# EasyEDA Pro project ProProject_BBM-USB_2024-03-22.epro, board PCB_BSBM-USB-O_3
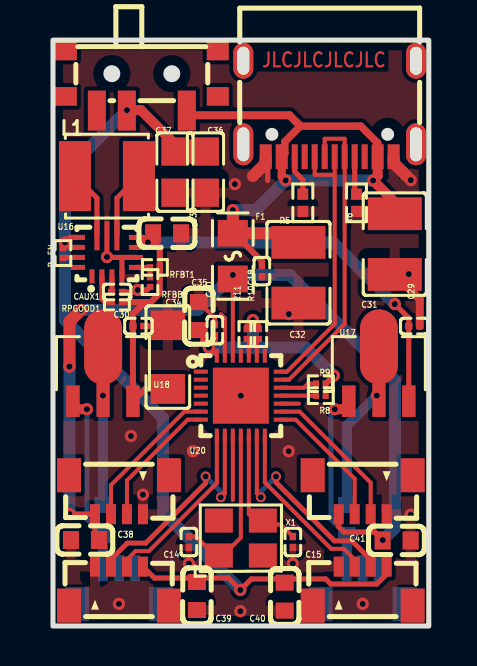
[diagram p7: board, top side]
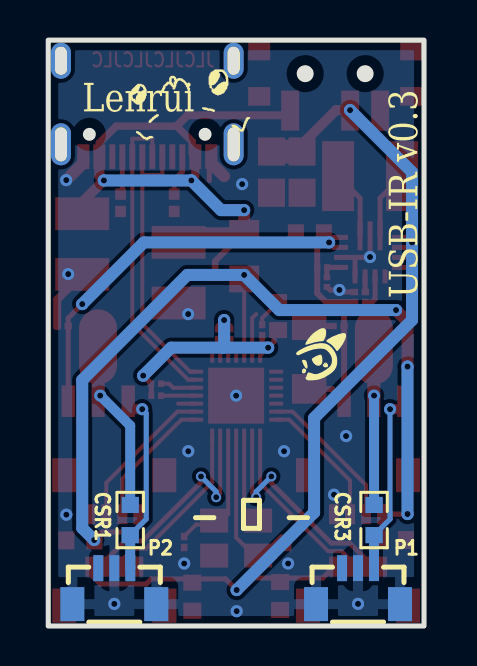
[diagram p8: board, bottom side, seen from below]

Outline 18.8 x 29.3 mm; copper layers: Top Layer, Top Inner1, Bottom Inner2, Bottom Layer. Coordinates in mm from the lower left corner of the outline.
Outline path: rectangle 0,29.3 18.8,0
Stack: Top Layer 0.035mm 外层铜厚1oz / Dielectric1 0.28mm 7628 RC49% 8.6mil / Top Inner1 0.035mm 内层铜厚 / Dielectric2 0.28mm 1.1mm H/HOZ 含铜 / Bottom Inner2 0.035mm 内层铜厚 / Dielectric3 0.28mm 7628 RC49% 8.6mil / Bottom Layer 0.035mm 外层铜厚1oz

## Design rules (mm)
template: User Custom Config
spacing Default (default): track to track 0.152, other pairs 0 to 0.152
track width Default (default): min 0.127, default 0.254, max 2.54
differential pair differentialPair (default): width min 0.127, default 0.254, max 2.54; gap min 0.152, default 0.152
via Default (default): diameter min 0.5, default 0.61, max 100.025; hole min 0.3, default 0.305, max 59.995

## Placement (name value [footprint] x y rotation side)
C14  12pF  [C0201]  6.8 4.2 270 top
C15  12pF  [C0201]  12 4.2 270 top
C18  100nF  [C0201]  10.45 17.75 270 top
C20  100nF  [C0201]  8.1 14.8 90 top
C29  100nF  [C0201]  18.07 15 180 top
C30  100nF  [C0201]  4.27 15 0 top
C31  100uF  [C1210]  17.1 19.1 90 top
C32  100uF  [C1210]  12.28 17.67 90 top
C33  10uF  [C0603]  5.71 19.64 0 top
C34  47uF  [C1206]  5.75 13.45 270 top
C35  10uF  [C0603]  7.3 15.5 90 top
C36  22uF  [C0805]  7.63 22.7 270 top
C37  22uF  [C0805]  6.1 22.7 270 top
C38  100uF  [C0603]  1.6 4.3 0 top
C39  100uF  [C0603]  7.2 1.5 270 top
C40  100uF  [C0603]  11.59 1.47 270 top
C41  100uF  [C0603]  17.19 4.28 0 top
CAUX1  100nF  [C0201]  3.21 16.7 0 top
CSR1  536Ω  [R0603]  14.7 5.3 270 bottom
CSR3  536Ω  [R0603]  2.5 5.3 270 bottom
F1  SMD0805B050TF  [F0805]  9 18.5 270 top
L1  2.2uH  [IND-SMD_L4.0-W4.0]  2.7 22.5 0 top
P1  SM03B-SURS-TF(LF)(SN)  [CONN-SMD_SM03B-SURS-TF-LF-SN]  3.3 1.99 0 bottom
P2  SM03B-SURS-TF(LF)(SN)  [CONN-SMD_SM03B-SURS-TF-LF-SN]  15.49 1.99 0 bottom
R5  5.1kΩ  [R0402]  12.5 21.17 90 top
R6  5.1kΩ  [R0402]  15.18 21.17 90 top
R8  DNP(56K)  [R0201]  13.4 11.52 180 top
R9  DNP(56K)  [R0201]  13.4 12.12 180 top
R10  DNP(56K)  [R0201]  10.3 14.6 270 top
R11  DNP(56K)  [R0201]  9.7 14.6 270 top
R-EN  10kΩ  [R0201]  0.5 18.65 270 top
RFBB1  100kΩ  [R0201]  4.86 17.2 90 top
RFBT1  845kΩ  [R0201]  5.1 17.93 0 top
RPGOOD1  100kΩ  [R0201]  3.2 16.2 0 top
SW1  MK-12C02-G020  [SW-SMD_MK-12C02-G020]  4.44 27.27 180 top
U12  SM04B-SURS-TF(LF)(SN)  [CONN-SMD_SM04B-SURS-TF-LF-SN]  3.3 6.57 180 top
U13  SM04B-SURS-TF(LF)(SN)  [CONN-SMD_SM04B-SURS-TF-LF-SN]  3.3 1.99 0 top
U14  SM04B-SURS-TF(LF)(SN)  [CONN-SMD_SM04B-SURS-TF-LF-SN]  15.49 1.99 0 top
U15  SM04B-SURS-TF(LF)(SN)  [CONN-SMD_SM04B-SURS-TF-LF-SN]  15.49 6.57 180 top
U16  TPS63070RNMR  [VQFN-HR-15_L3.0-W2.5-P0.50-BL_TPS63070RNMR]  2.7 18.5 0 top
U17  LM317LIPK  [SOT-89_L4.5-W2.5-P1.50-LS4.2-BR]  16.3 12.6 270 top
U18  LM317LIPK  [SOT-89_L4.5-W2.5-P1.50-LS4.2-BR]  2.5 12.6 270 top
U19  GT-USB-7010ASV  [USB-C-SMD_G-SWITCH_GT-USB-7010ASV]  13.84 25.87 180 top
U20  CH335F  [QFN-28_L4.0-W4.0-P0.40-TL-EP2.8]  9.4 11.52 0 top
X1  12MHz  [OSC-SMD_4P-L3.2-W2.5-BL]  9.4 4.4 0 top

## Footprints (pads in the part's own frame, mm; a bottom-side part is the same pattern mirrored in y, then rotated)
C0201
  rect 0.368x0.324 smd: 1(-0.275,0) 2(0.275,0)
C0603
  rect 0.8x0.9 smd: 1(-0.7,0) 2(0.7,0)
C0805
  rect 1.41x1.35 smd: 1(-1.03,0) 2(1.03,0)
C1206
  rect 1.485x1.728 smd: 1(-1.593,0) 2(1.593,0)
C1210
  rect 1.635x2.7 smd: 1(-1.518,0) 2(1.518,0)
CONN-SMD_SM03B-SURS-TF-LF-SN
  rect 0.5x1.3 smd: 1(0.8,-0.899) 2(0,-0.899) 3(-0.8,-0.9)
  rect 1.2x1.7 smd: 4(-2.1,0.9) 5(2.1,0.9)
CONN-SMD_SM04B-SURS-TF-LF-SN
  rect 0.5x1 smd: 1(-1.2,0.975) 2(-0.4,0.975) 3(0.4,0.975) 4(1.2,0.975)
  rect 1.2x1.7 smd: 5(2.5,-0.975) 6(-2.5,-0.975)
F0805
  rect 1.335x1.5 smd: 1(-1.143,0) 2(1.143,0)
IND-SMD_L4.0-W4.0
  rect 1.6x3.5 smd: 1(-1.6,0) 2(1.6,0)
OSC-SMD_4P-L3.2-W2.5-BL
  rect 1.4x1.2 smd: 1(-1.1,-0.875) 2(1.1,-0.875) 3(1.1,0.875) 4(-1.1,0.875)
QFN-28_L4.0-W4.0-P0.40-TL-EP2.8
  rect 0.7x0.2 smd: 1(-2,1.2) 2(-2,0.8) 3(-2,0.4) 4(-2,0.001) 5(-2,-0.4) 6(-2,-0.8) 7(-2,-1.2) 15(2,-1.2) 16(2,-0.8) 17(2,-0.4) 18(2,0) 19(2,0.4) 20(2,0.8) 21(2,1.2)
  rect 0.2x0.7 smd: 8(-1.2,-2) 9(-0.8,-2) 10(-0.4,-2) 11(0,-2) 12(0.4,-2) 13(0.8,-2) 14(1.2,-2) 22(1.2,2) 23(0.8,2) 24(0.4,2) 25(0,2) 26(-0.4,2) 27(-0.8,2) 28(-1.2,2)
  rect 2.8x2.8 smd: 29(0.001,-0.001)
R0201
  rect 0.303x0.324 smd: 1(-0.241,0) 2(0.241,0)
R0402
  rect 0.566x0.54 smd: 1(-0.433,0) 2(0.433,0)
R0603
  rect 0.806x0.864 smd: 1(-0.753,0) 2(0.753,0)
SOT-89_L4.5-W2.5-P1.50-LS4.2-BR
  rect 1.575x0.672 smd: 1(1.356,-1.5) 3(1.356,1.5)
  custom 5.377x1.9 smd: 2(-1.356,0.009)
SW-SMD_MK-12C02-G020
  rect 0.9x2 smd: 1(-2.25,1.49) 2(0.75,1.49) 3(2.25,1.49)
  rect 1.1x0.93 smd: 4(3.8,0.779) 5(3.8,-1.49) 6(-3.8,-1.49) 7(-3.8,0.779)
USB-C-SMD_G-SWITCH_GT-USB-7010ASV
  oval 1x2.1 hole 0.6x1.7: 1(-4.32,1.78) 2(4.32,1.78)
  oval 1x1.8 hole 0.6x1.4: 3(4.32,-2.4) 4(-4.32,-2.4)
  rect 0.6x1.24 smd: A1B12(-3.2,2.4) A4B9(-2.4,2.4) B1A12(3.2,2.4) B4A9(2.4,2.4)
  rect 0.3x1.24 smd: A5(-1.25,2.4) A6(-0.25,2.4) A7(0.25,2.4) A8(1.25,2.4) B5(1.75,2.4) B6(0.75,2.4) B7(-0.75,2.4) B8(-1.75,2.4)
VQFN-HR-15_L3.0-W2.5-P0.50-BL_TPS63070RNMR
  rect 0.25x0.7 smd: 1(-0.75,-1.016) 2(-0.25,-1.016) 3(0.25,-1.016) 4(0.75,-1.016)
  rect 0.7x0.25 smd: 5(1.45,-0.566) 6(1.45,-0.066) 7(1.45,0.434) 8(1.45,0.934) 12(-1.45,0.434) 13(-1.45,0.934) 14(-1.45,-0.066) 15(-1.45,-0.566)
  rect 0.25x1.45 smd: 9(0.5,1.016) 11(-0.5,1.016)
  rect 0.25x1.85 smd: 10(0,0.817)

## Nets
7.5VO: C29.2 C30.1 C33.1 C34.2 RFBT1.2 RPGOOD1.2 U16.7 U16.8 U17.3 U18.3
GND: C14.2 C15.2 C18.2 C20.2 C29.1 C30.2 C31.1 C32.1 C33.2 C34.1 C35.2 C36.2 C37.2 C38.1 C39.2 C40.2 C41.2 CAUX1.2 P1.2 P1.4 P1.5 P2.2 P2.4 P2.5 R5.1 R6.1 RFBB1.1 U12.1 U13.1 U14.1 U15.1 U16.4 U16.6 U16.10 U19.A1B12 U19.B1A12 U20.27 U20.29
VCC5: C38.2 C41.1 F1.2 U12.4 U15.4 U20.26
VCC33: C20.1 C35.1 R8.1 R9.1 R10.1 R11.1 U20.28
VIN: C18.1 C31.2 C32.2 F1.1 SW1.1 U19.A4B9 U19.B4A9
CSR1: CSR1.1 U17.2
CSR3: CSR3.1 U18.2
DM1: U12.3 U20.6
DM2: U13.3 U20.8
DM3: U14.3 U20.13
DM4: U15.3 U20.15
DMU: U19.A7 U19.B7 U20.20
DP1: U12.2 U20.7
DP2: U13.2 U20.9
DP3: U14.2 U20.14
DP4: U15.2 U20.16
DPU: U19.A6 U19.B6 U20.21
EN: R-EN.2 U16.14
FB: RFBB1.2 RFBT1.1 U16.5
IRO1: CSR3.2 P1.3 U18.1
IRO2: CSR1.2 P2.3 U17.1
L1: L1.1 U16.11
L2: L1.2 U16.9
LED1: U20.1
LED2: U20.3
LED3: U20.22
LED4: U20.25
OVCUR1: R11.2 U20.24
OVCUR2: R10.2 U20.23
OVCUR3: R9.2 U20.19
OVCUR4: R8.2 U20.18
PG: RPGOOD1.1 U16.2
PWREN1: U20.4
PWREN2: U20.2
PWREN3: U20.10
PWREN4: U20.5
USBO: C36.1 C37.1 C39.1 C40.1 R-EN.1 SW1.2 U13.4 U14.4 U16.12 U16.13
VAUX: CAUX1.1 U16.3
XI: C14.1 U20.11 X1.1
XO: C15.1 U20.12 X1.3
$1N11513: R5.2 U19.B5
$1N11542: R6.2 U19.A5

Pads without a net: P1 1; P2 1; SW1 3 4 5 6 7; U12 5 6; U13 5 6; U14 5 6; U15 5 6; U16 1 15; U19 1 2 3 4 A8 B8; U20 17; X1 2 4

## Via types
v1: diameter 0.61, hole 0.305, Top Layer to Bottom Layer, 37 vias
v2: diameter 0.5, hole 0.3, Top Layer to Bottom Layer, 4 vias

## Routing (per net, layer and track width the routed paths; a pad name or vN(x,y) marks a point on that pad's centre or on a via; arc(x,y) is an arc through that point)
7.5VO: length 33.2
  Top Layer w0.254: 17.8,14.9 17.8,15.4 v1(17.1,16.1) ; U16.8 4.5,19.43 v1(4.75,19.18) 4.5,18.93 U16.7 ; 17.8,10.64 17.8,14.83
  Top Layer w0.3: v1(4.75,19.18) 5.1,19.18 5.34,18.94 RFBT1.2 5.34,16.64 4.9,16.2 4.6,16.2 ; 4,10.64 U18.3 ; U18.3 4,14.94 ; U18.3 4.61,11.86 5.55,11.86 ; 4.6,16.2 4,15.6 C30.1 ; 4.6,16.2 3.54,16.2
  Bottom Layer w0.6: v1(17.1,16.1) 14.02,19.18 v1(4.75,19.18)
GND: length 15.5
  Top Layer w0.2: 8.4,15.6 8.6,15.4 U20.27 ; C35.2 8.1,15.4 C20.2
  Top Layer w0.254: U16.6 3.41,18.43 ; 3.41,18.43 2.72,18.43 v1(2.7,18.45) ; 3.41,18.43 3.45,18.39 U16.4 ; 10.64,23.47 10.74,23.37 10.74,22.28 ; CAUX1.2 4.13,16.7 v1(4.23,16.81) 4.71,16.81 RFBB1.1
  Top Layer w0.3: C34.1 5.7,15 C30.2
  Top Layer w0.4: C31.1 18.35,16.33 C29.1
  Top Layer w0.6: 10.64,23.47 10.64,23.14 10,22.5 ; 17.04,23.47 17.04,23.16 17.7,22.5
  vias: v1(3.3,1.11) v1(3.9,9.5) v1(4.5,6.57) v1(6.8,3.13) v1(7,8.74) v1(9.1,22.1) v1(9.4,11.52) v1(9.37,0.74) v1(11.8,15.6) v1(11.79,8.74) v1(12,3.13) v1(15.49,1.11) v1(17.8,17.6) v1(17.9,22.3) v1(17.89,5.57)
VCC5: length 47.1
  Top Layer w0.2: v1(9,17.56) U20.26
  Top Layer w0.254: U15.4 14.29,4.97 14.56,4.7 16.1,4.7 v1(16.5,4.3) ; 2.1,4.3 2.1,5.38 1.88,5.6 v1(0.83,5.6)
  Top Layer w0.5: 2.1,5.38 2.1,5.59 U12.4
  Top Layer w0.6: v1(0.83,12.97) 0.83,15.23 v1(1.4,15.8)
  Bottom Layer w0.254: v1(0.83,12.97) 0.8,13
  Bottom Layer w0.6: v1(16.5,4.3) 17.1,4.9 17.1,12.3 11.84,17.56 v1(9,17.56) 7.24,15.8 v1(1.4,15.8) ; v1(0.83,5.6) v1(0.83,12.97)
VCC33: length 13
  Top Layer w0.2: U20.28 v1(7.8,13.92)
  Top Layer w0.254: R9.1 14.04,12.52 14.05,12.52 13.64,12.11 R8.1 ; 7.5,14.43 7.5,14.22 v1(7.8,13.92) 8.1,14.22 8.1,14.43 ; R11.1 9.7,15 v1(10,15.3) 10.3,15 R10.1
  Bottom Layer w0.6: v1(10,15.3) 10,13.98 10.06,13.92 ; 10.06,13.92 v1(7.8,13.92) ; 10.06,13.92 12.65,13.92 v1(14.05,12.52)
VIN: length 31.9
  Top Layer w0.3: 9.25,19.64 9.25,19.45 10.45,18.25 C18.1
  Top Layer w0.37: 11.44,23.47 11.6,23.63 11.6,24.22 12.38,25 15.4,25 16.24,24.16 16.24,23.47
  Top Layer w0.4: v1(11.64,22.28) 11.44,22.48 11.44,23.47 ; SW1.1 6.93,25.54 11.83,25.54 12.38,25
  Top Layer w0.5: C31.2 17.1,21.2 v1(16.02,22.28) 16.24,22.51 16.24,23.47
  Top Layer w0.6: v1(9,20.8) 9,19.64 F1.1 11.83,19.64 C32.2
  Bottom Layer w0.6: v1(9,20.8) 10.16,20.8 v1(11.64,22.28) v1(16.02,22.28)
(no net): length 0.9
  Top Layer w0.2: U20.17 12.3,11.12
CSR1: length 6.1
  Bottom Layer w0.5: CSR1.1 14.7,10.02 v1(16.2,11.52)
CSR3: length 5.5
  Bottom Layer w0.5: CSR3.1 v1(2.5,11.52)
DM1: length 7.5
  Top Layer w0.2: U12.3 2.9,7.05 6.57,10.72 7.4,10.72
DM2: length 8.8
  Top Layer w0.2: U20.8 8.2,7.14 4.8,3.74 4.13,3.74 3.7,3.32 U13.3
DM3: length 11.5
  Top Layer w0.2: U20.13 10.2,6.64 v2(10.4,6.44)
  Top Layer w0.245: v2(11.16,7.48) 11.16,7.18 14.08,4.26 14.95,4.26 15.89,3.32 U14.3
  Bottom Layer w0.254: v2(10.4,6.44) 10.4,6.72 v2(11.16,7.48)
DM4: length 6.7
  Top Layer w0.2: U15.3 15.09,7.37 12.14,10.32 U20.15
DMU: length 15.4
  Top Layer w0.2: 13.59,23.47 13.59,24.37 14.59,24.37 14.59,23.47 14.59,15.11 11.81,12.32 11.47,12.32
DP1: length 6.6
  Top Layer w0.2: U20.7 6.74,10.32 3.7,7.28 U12.2
DP2: length 11.5
  Top Layer w0.2: U20.9 8.6,6.64 v2(8.4,6.44)
  Top Layer w0.245: v2(7.64,7.48) 7.64,7.15 4.64,4.15 3.72,4.15 2.9,3.33 U13.2
  Bottom Layer w0.254: v2(7.64,7.48) 8.4,6.72 v2(8.4,6.44)
DP3: length 8.8
  Top Layer w0.2: U20.14 10.6,7.18 13.92,3.86 14.55,3.86 15.09,3.32 U14.2
DP4: length 7.5
  Top Layer w0.2: U15.2 15.89,7.17 12.34,10.72 U20.16
DPU: length 14
  Top Layer w0.2: U20.21 11.71,12.72 14.09,15.11 14.09,22.62 ; 14.09,22.62 14.05,22.57 13.09,22.57 13.09,23.47 ; 14.09,22.62 14.09,23.47
EN: length 0.8
  Top Layer w0.254: R-EN.2 0.53,18.43 U16.14
FB: length 1.2
  Top Layer w0.254: RFBB1.2 RFBT1.1 U16.5
IRO1: length 9
  Top Layer w0.5: v1(1.7,10.84) 1,10.84
  Bottom Layer w0.254: CSR3.2 1.7,5.35 v1(1.7,10.84) ; 2.5,2.9 2.5,2.89
  Bottom Layer w0.5: P1.3 2.5,4.54 CSR3.2
IRO2: length 9.1
  Top Layer w0.5: 14.8,10.84 v1(14.1,10.84)
  Bottom Layer w0.254: v1(14.1,10.84) 13.9,10.64 13.9,5.35 CSR1.2
  Bottom Layer w0.5: CSR1.2 14.7,2.9 P2.3
L1: length 3.4
  Top Layer w0.254: U16.11 2.2,21.4 L1.1
L2: length 3.4
  Top Layer w0.254: L1.2 3.2,21.4 U16.9
OVCUR1: length 0.9
  Top Layer w0.2: U20.24 9.8,14.26 R11.2
OVCUR2: length 0.9
  Top Layer w0.2: U20.23 10.2,14.26 R10.2
OVCUR3: length 1.8
  Top Layer w0.2: R9.2 12.75,12.12 12.55,11.91 U20.19
OVCUR4: length 1.8
  Top Layer w0.2: U20.18 R8.2
PG: length 1.7
  Top Layer w0.254: RPGOOD1.1 2.6,16.2 2.45,16.35 U16.2
PWREN3: length 3.2
  Top Layer w0.2: U20.10 9,6.3
USBO: length 49.4
  Top Layer w0.254: v1(0.6,19.18) 0.85,18.93 U16.12 ; v1(0.6,19.18) 0.6,18.99 R-EN.1 ; v1(0.6,19.18) 0.85,19.43 U16.13 ; U13.4 5.07,2.4 8.77,2.4 v1(9.37,1.8) 9.93,2.35 13.65,2.35 13.9,2.1 16.2,2.1 16.69,2.59 U14.4
  Top Layer w0.5: C37.1 6.1,24.1 4.4,25.8 v1(3.7,25.8)
  Top Layer w1.2: C37.1 C36.1
  Bottom Layer w0.6: v1(9.37,1.8) 5.5,5.67 5.5,10.4 0.6,15.3 v1(0.6,19.18) 0.6,22.7 v1(3.7,25.8)
VAUX: length 0.8
  Top Layer w0.254: CAUX1.1 2.95,16.72 U16.3
XI: length 8.6
  Top Layer w0.2: C14.1 7.15,4.47 8.3,3.33 9.4,4.42 U20.11
XO: length 6.6
  Top Layer w0.2: C15.1 11.4,5.08 10.32,5.08 9.8,5.6 U20.12
$1N11513: length 2
  Top Layer w0.254: 12.5,21.63 12.5,22.32 12.09,22.72 12.09,23.47
$1N11542: length 1.9
  Top Layer w0.254: 15.09,23.47 15.09,21.69 R6.2

## Copper pours and planes (outline as drawn; the poured copper is in the pictures)
GND on Top Layer: -2.84,29.39 18.75,29.39 18.75,-2.23 -2.84,-2.23
GND on Bottom Layer: -0.05,31.6 21.54,31.6 21.54,-0.03 -0.05,-0.03

## Text on the board
Bottom Silkscreen Layer: USB-IR v0.3 | - ⩊ - | Lenrui
Top Layer: JLCJLCJLCJLC
